# EAGLE design saha-cpu (EAGLE 9.4.0)

## Sheet 1 of 4
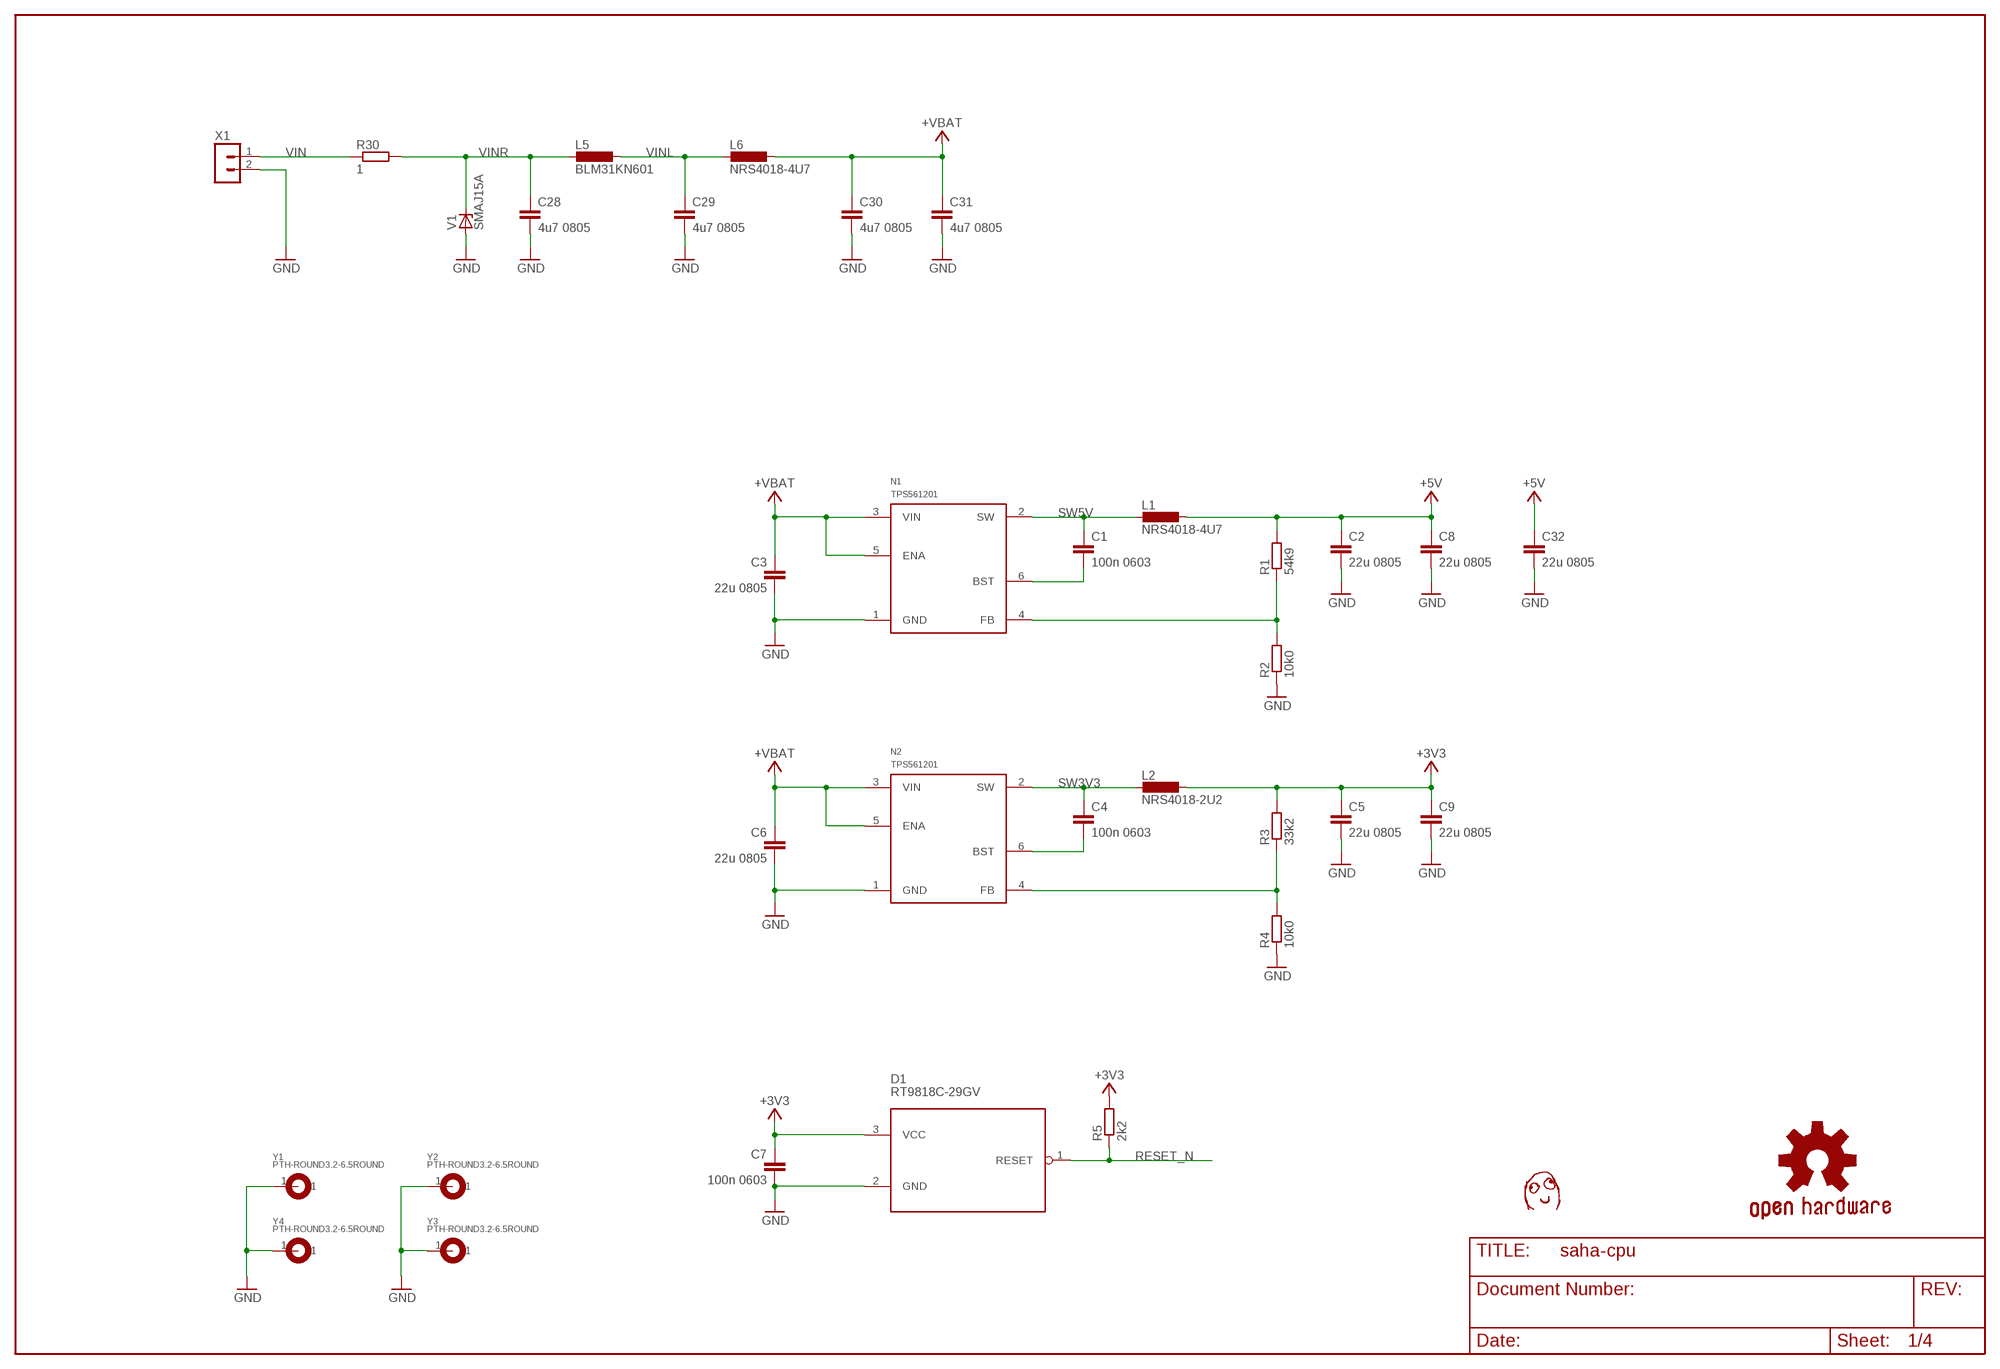
[diagram p0: schematic, sheet 1]

### Parts
C1  100n 0603  CAP0603  [C0603]
C2  22u 0805  CAP0805  [C0805]
C3  22u 0805  CAP0805  [C0805]
C4  100n 0603  CAP0603  [C0603]
C5  22u 0805  CAP0805  [C0805]
C6  22u 0805  CAP0805  [C0805]
C7  100n 0603  CAP0603  [C0603]
C8  22u 0805  CAP0805  [C0805]
C9  22u 0805  CAP0805  [C0805]
C28  4u7 0805  CAP0805  [C0805]
C29  4u7 0805  CAP0805  [C0805]
C30  4u7 0805  CAP0805  [C0805]
C31  4u7 0805  CAP0805  [C0805]
C32  22u 0805  CAP0805  [C0805]
D1  RT9818C-29GV  [SOT23]
L1  NRS4018-4U7  [NRS4018]
L2  NRS4018-2U2  [NRS4018]
L5  BLM31KN601  IND1206  [R1206]
L6  NRS4018-4U7  [NRS4018]
N1  TPS561201  [OMAT_IC_2_SOT23-6]
N2  TPS561201  [OMAT_IC_2_SOT23-6]
R1  54k9  RES0603  [R0603]
R2  10k0  RES0603  [R0603]
R3  33k2  RES0603  [R0603]
R4  10k0  RES0603  [R0603]
R5  2k2  RES0603  [R0603]
R30  1  RES2512  [R2512]
U$1  DAFUG  [DAFUG]
V1  SMAJ15A  SMAJXXA  [DO214AC]
X1  TE_RUUVILIITIN2  [TE_RUUVILIITIN2]
Y1  PTH-ROUND3.2-6.5ROUND  [EKE_PTH-3.2-6.5]
Y2  PTH-ROUND3.2-6.5ROUND  [EKE_PTH-3.2-6.5]
Y3  PTH-ROUND3.2-6.5ROUND  [EKE_PTH-3.2-6.5]
Y4  PTH-ROUND3.2-6.5ROUND  [EKE_PTH-3.2-6.5]

### Nets
+3V3 [power]: C5.1 C7.1 C9.1 D1.3(VCC) L2.1 R3.2 R5.2 ; also sheet 2,3,4
+5V [power]: C2.1 C8.1 C32.1 L1.1 R1.2 ; also sheet 3,4
+VBAT [power]: C3.1 C6.1 C30.1 C31.1 L6.1 N1.3(VIN) N1.5(ENA) N2.3(VIN) N2.5(ENA) ; also sheet 2
GND [power]: C2.2 C3.2 C5.2 C6.2 C7.2 C8.2 C9.2 C28.2 C29.2 C30.2 C31.2 C32.2 D1.2(GND) N1.1(GND) N2.1(GND) R2.1 R4.1 V1.A X1.2 Y1.1 Y2.1 Y3.1 Y4.1 ; also sheet 2,3,4
N$1: N2.4(FB) R3.1 R4.2
N$3: N1.4(FB) R1.1 R2.2
N$5: C1.2 N1.6(BST)
N$7: C4.2 N2.6(BST)
RESET_N: D1.1(RESET) R5.1 ; also sheet 2
SW3V3: C4.1 L2.2 N2.2(SW)
SW5V: C1.1 L1.2 N1.2(SW)
VIN: R30.1 X1.1
VINL: C29.1 L5.1 L6.2
VINR: C28.1 L5.2 R30.2 V1.C

## Sheet 2 of 4
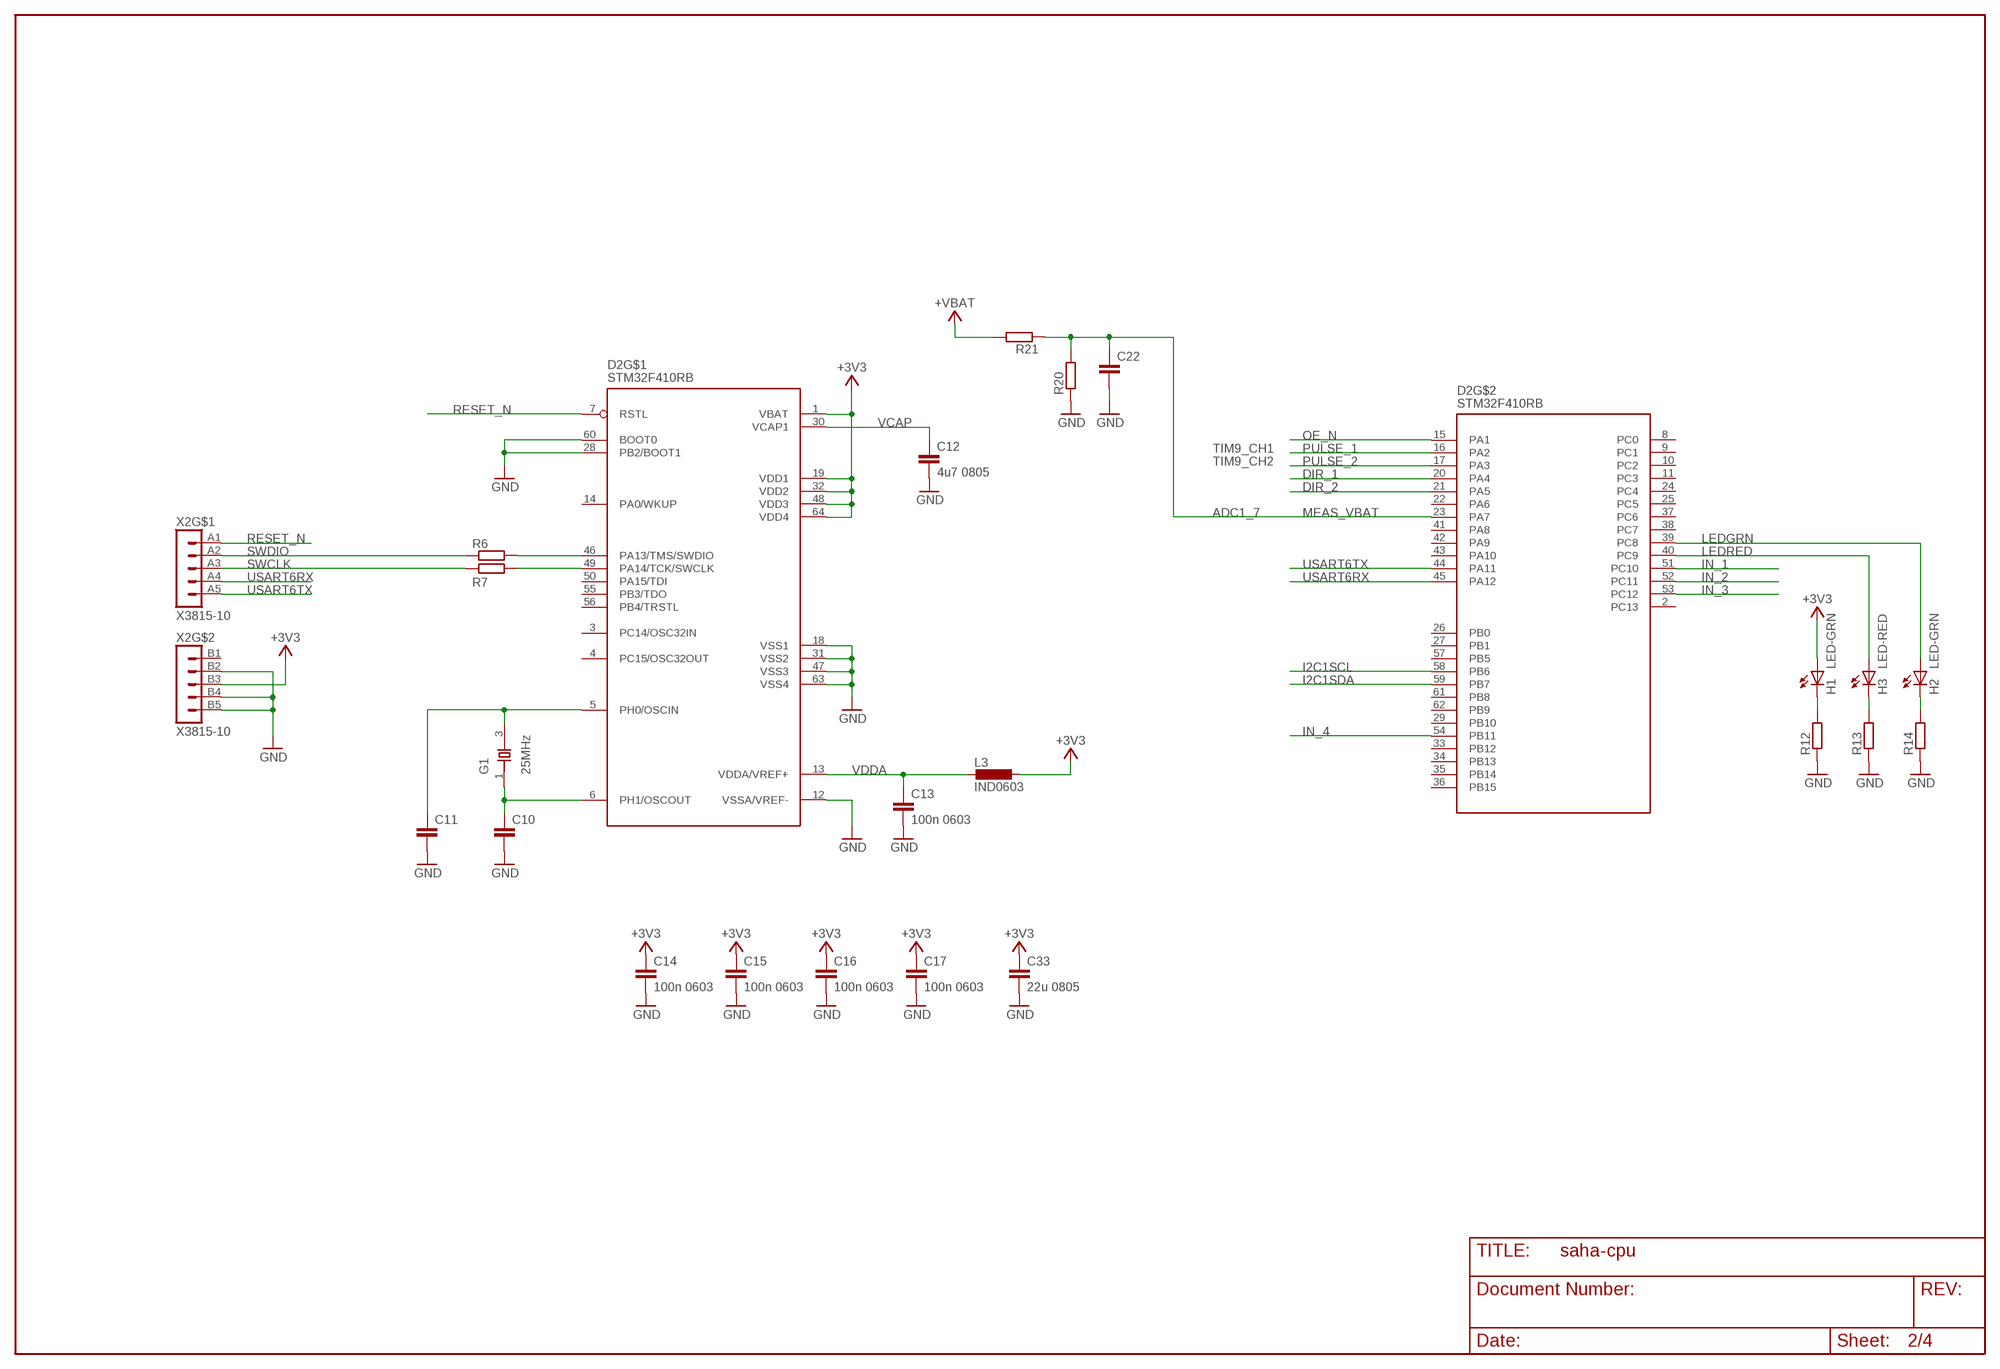
[diagram p1: schematic, sheet 2]

### Parts
C10  CAP0603  [C0603]
C11  CAP0603  [C0603]
C12  4u7 0805  CAP0805  [C0805]
C13  100n 0603  CAP0603  [C0603]
C14  100n 0603  CAP0603  [C0603]
C15  100n 0603  CAP0603  [C0603]
C16  100n 0603  CAP0603  [C0603]
C17  100n 0603  CAP0603  [C0603]
C22  CAP0603  [C0603]
C33  22u 0805  CAP0805  [C0805]
D2  STM32F410RB  [LQFP-64]
G1  25MHz  XTAL_3225_SMD  [X_3225]
H1  LED-GRN  [CHIP-LED0603]
H2  LED-GRN  [CHIP-LED0603]
H3  LED-RED  [CHIP-LED0603]
L3  IND0603  [R0603]
R6  RES0603  [R0603]
R7  RES0603  [R0603]
R12  RES0603  [R0603]
R13  RES0603  [R0603]
R14  RES0603  [R0603]
R20  RES0603  [R0603]
R21  RES0603  [R0603]
X2  X3815-10  [AUX-IO_LIITTIMET_15110102601]

### Nets
+3V3 [power]: C14.1 C15.1 C16.1 C17.1 C33.1 D2.1(VBAT) D2.19(VDD1) D2.32(VDD2) D2.48(VDD3) D2.64(VDD4) H1.A L3.1 X2.B3 ; also sheet 1,3,4
+VBAT [power]: R21.2 ; also sheet 1
DIR_1: D2.20(PA4) ; also sheet 3
DIR_2: D2.21(PA5) ; also sheet 3
GND [power]: C10.2 C11.2 C12.2 C13.2 C14.2 C15.2 C16.2 C17.2 C22.2 C33.2 D2.12(VSSA/VREF-) D2.18(VSS1) D2.28(PB2/BOOT1) D2.31(VSS2) D2.47(VSS3) D2.60(BOOT0) D2.63(VSS4) R12.1 R13.1 R14.1 R20.1 X2.B2 X2.B4 X2.B5 ; also sheet 1,3,4
I2C1SCL: D2.58(PB6) ; also sheet 3
I2C1SDA: D2.59(PB7) ; also sheet 3
IN_1: D2.51(PC10) ; also sheet 4
IN_2: D2.52(PC11) ; also sheet 4
IN_3: D2.53(PC12) ; also sheet 4
IN_4: D2.54(PB11) ; also sheet 4
LEDGRN: D2.39(PC8) H2.A
LEDRED: D2.40(PC9) H3.A
MEAS_VBAT: C22.1 D2.23(PA7) R20.2 R21.1
N$22: H1.C R12.2
N$23: H3.C R13.2
N$24: H2.C R14.2
OE_N: D2.15(PA1) ; also sheet 3
OSCIN: C11.1 D2.5(PH0/OSCIN) G1.3(X2)
OSCOUT: C10.1 D2.6(PH1/OSCOUT) G1.1(X1)
PULSE_1: D2.16(PA2) ; also sheet 3
PULSE_2: D2.17(PA3) ; also sheet 3
RESET_N: D2.7(RSTL) X2.A1 ; also sheet 1
SWCLK: R7.1 X2.A3
SWCLK-CPU: D2.49(PA14/TCK/SWCLK) R7.2
SWDIO: R6.1 X2.A2
SWDIO-CPU: D2.46(PA13/TMS/SWDIO) R6.2
USART6RX: D2.45(PA12) X2.A4
USART6TX: D2.44(PA11) X2.A5
VCAP [power]: C12.1 D2.30(VCAP1)
VDDA [power]: C13.1 D2.13(VDDA/VREF+) L3.2
Unconnected: D2.2(PC13) D2.3(PC14/OSC32IN) D2.4(PC15/OSC32OUT) D2.8(PC0) D2.9(PC1) D2.10(PC2) D2.11(PC3) D2.14(PA0/WKUP) D2.22(PA6) D2.24(PC4) D2.25(PC5) D2.26(PB0) D2.27(PB1) D2.29(PB10) D2.33(PB12) D2.34(PB13) D2.35(PB14) D2.36(PB15) D2.37(PC6) D2.38(PC7) D2.41(PA8) D2.42(PA9) D2.43(PA10) D2.50(PA15/TDI) D2.55(PB3/TDO) D2.56(PB4/TRSTL) D2.57(PB5) D2.61(PB8) D2.62(PB9) X2.B1

### Notes on the sheet
- TIM9_CH1
- TIM9_CH2
- ADC1_7

## Sheet 3 of 4
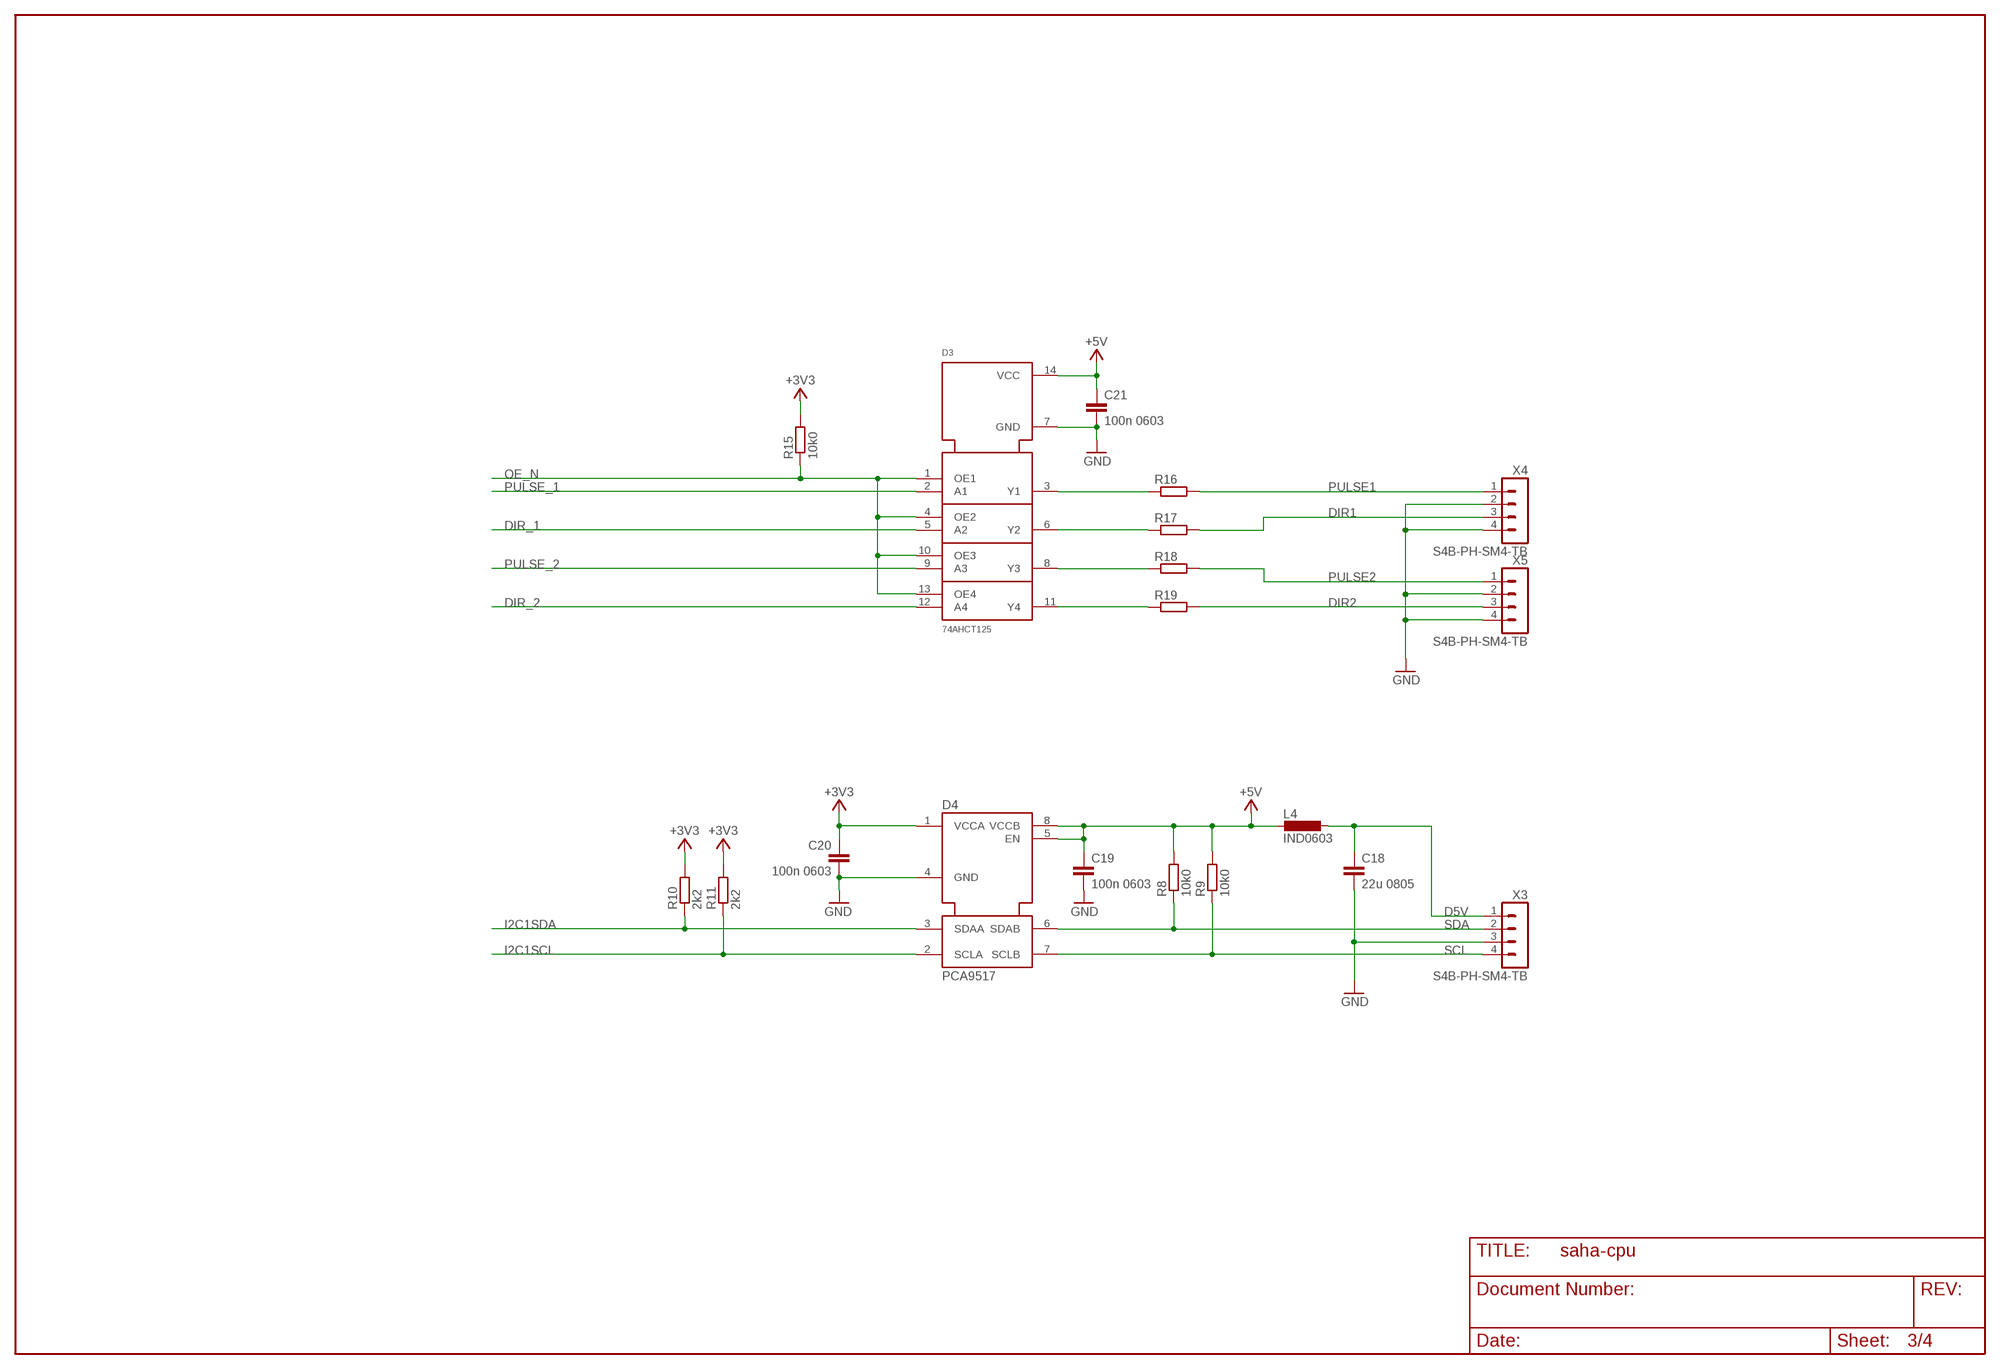
[diagram p2: schematic, sheet 3]

### Parts
C18  22u 0805  CAP0805  [C0805]
C19  100n 0603  CAP0603  [C0603]
C20  100n 0603  CAP0603  [C0603]
C21  100n 0603  CAP0603  [C0603]
D3  74AHCT125  [SO14]
D4  PCA9517  [OMAT_IC_2_SOIC8-N_MC]
L4  IND0603  [R0603]
R8  10k0  RES0603  [R0603]
R9  10k0  RES0603  [R0603]
R10  2k2  RES0603  [R0603]
R11  2k2  RES0603  [R0603]
R15  10k0  RES0603  [R0603]
R16  RES0603  [R0603]
R17  RES0603  [R0603]
R18  RES0603  [R0603]
R19  RES0603  [R0603]
X3  S4B-PH-SM4-TB  [JST-PH2.0-RA-4]
X4  S4B-PH-SM4-TB  [JST-PH2.0-RA-4]
X5  S4B-PH-SM4-TB  [JST-PH2.0-RA-4]

### Nets
+3V3 [power]: C20.1 D4.1(VCCA) R10.2 R11.2 R15.2 ; also sheet 1,2,4
+5V [power]: C19.1 C21.1 D3.14(VCC) D4.5(EN) D4.8(VCCB) L4.2 R8.2 R9.2 ; also sheet 1,4
D5V: C18.1 L4.1 X3.1
DIR1: R17.2 X4.3
DIR2: R19.2 X5.3
DIR_1: D3.5(A2) ; also sheet 2
DIR_2: D3.12(A4) ; also sheet 2
GND [power]: C18.2 C19.2 C20.2 C21.2 D3.7(GND) D4.4(GND) X3.3 X4.2 X4.4 X5.2 X5.4 ; also sheet 1,2,4
I2C1SCL: D4.2(SCLA) R11.1 ; also sheet 2
I2C1SDA: D4.3(SDAA) R10.1 ; also sheet 2
N$21: D3.11(Y4) R19.1
N$25: D3.8(Y3) R18.1
N$26: D3.6(Y2) R17.1
N$27: D3.3(Y1) R16.1
OE_N: D3.1(OE1) D3.4(OE2) D3.10(OE3) D3.13(OE4) R15.1 ; also sheet 2
PULSE1: R16.2 X4.1
PULSE2: R18.2 X5.1
PULSE_1: D3.2(A1) ; also sheet 2
PULSE_2: D3.9(A3) ; also sheet 2
SCL: D4.7(SCLB) R9.1 X3.4
SDA: D4.6(SDAB) R8.1 X3.2

## Sheet 4 of 4
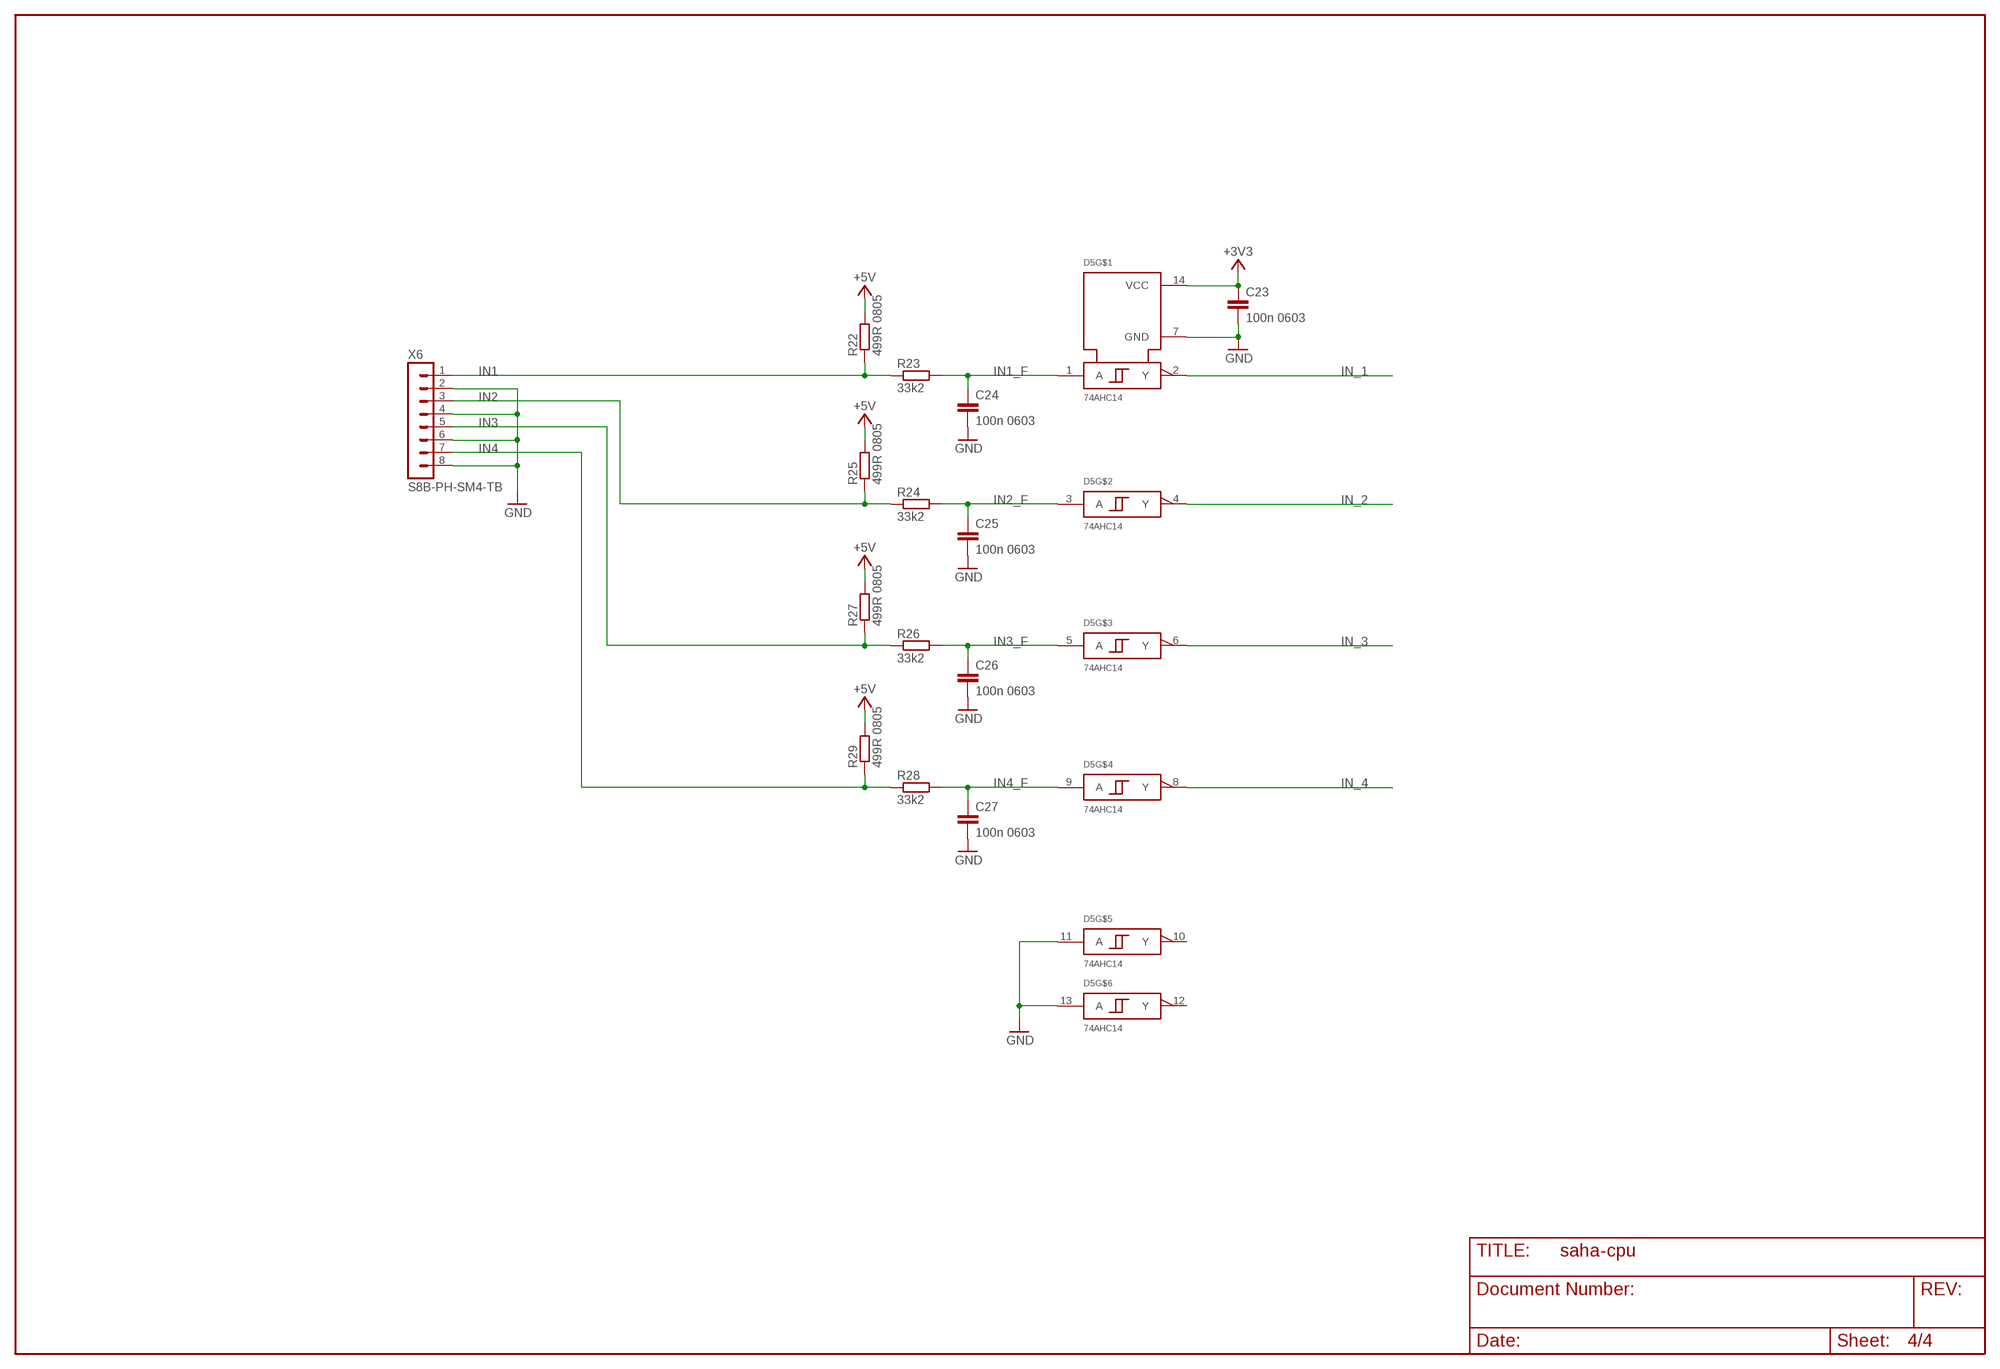
[diagram p3: schematic, sheet 4]

### Parts
C23  100n 0603  CAP0603  [C0603]
C24  100n 0603  CAP0603  [C0603]
C25  100n 0603  CAP0603  [C0603]
C26  100n 0603  CAP0603  [C0603]
C27  100n 0603  CAP0603  [C0603]
D5  74AHC14  [SO14]
R22  499R 0805  RES0805  [R0805]
R23  33k2  RES0603  [R0603]
R24  33k2  RES0603  [R0603]
R25  499R 0805  RES0805  [R0805]
R26  33k2  RES0603  [R0603]
R27  499R 0805  RES0805  [R0805]
R28  33k2  RES0603  [R0603]
R29  499R 0805  RES0805  [R0805]
X6  S8B-PH-SM4-TB  [JST-PH2.0-RA-8]

### Nets
+3V3 [power]: C23.1 D5.14(VCC) ; also sheet 1,2,3
+5V [power]: R22.2 R25.2 R27.2 R29.2 ; also sheet 1,3
GND [power]: C23.2 C24.2 C25.2 C26.2 C27.2 D5.7(GND) D5.11(A) D5.13(A) X6.2 X6.4 X6.6 X6.8 ; also sheet 1,2,3
IN1: R22.1 R23.1 X6.1
IN1_F: C24.1 D5.1(A) R23.2
IN2: R24.1 R25.1 X6.3
IN2_F: C25.1 D5.3(A) R24.2
IN3: R26.1 R27.1 X6.5
IN3_F: C26.1 D5.5(A) R26.2
IN4: R28.1 R29.1 X6.7
IN4_F: C27.1 D5.9(A) R28.2
IN_1: D5.2(Y) ; also sheet 2
IN_2: D5.4(Y) ; also sheet 2
IN_3: D5.6(Y) ; also sheet 2
IN_4: D5.8(Y) ; also sheet 2
Unconnected: D5.10(Y) D5.12(Y)

## Library data of the parts
C1-C33 = saha-cpu:CAP
D1 = saha-cpu:RT9818C-29GV
D2 = saha-cpu:STM32F410RB
D3 = saha-cpu:74AHCT125
D4 = saha-cpu:PCA9517
D5 = saha-cpu:74AHC14
G1 = saha-cpu:XTAL_3225_SMD: CRYSTAL CLOCK OSCILLATORS 5.0 Vdc or 3.3 Vdc - LOW PROFILE ULTRA MINIATURE CERAMIC SURFACE MOUNT Source: http://www.abracon.com/Oscillators/asf1-L-L1.pdf
H1-H3 = saha-cpu:LED
L1 L2 L6 = saha-cpu:NRS4018
L3-L5 = saha-cpu:IND
N1 N2 = saha-cpu:TPS561201
R1-R30 = saha-cpu:RES
U$1 = saha-cpu:DAFUG
V1 = saha-cpu:SMAJXXA
X1 = saha-cpu:TE_RUUVILIITIN2
X2 = saha-cpu:X3815-10
X3-X5 = saha-cpu:S4B-PH-SM4-TB
X6 = saha-cpu:S8B-PH-SM4-TB
Y1-Y4 = saha-cpu:PTH-ROUND

## Net classes
0 default: width 0.15 mm, drill 0.3 mm
1 power: width 0.3 mm, drill 0.3 mm

## Board
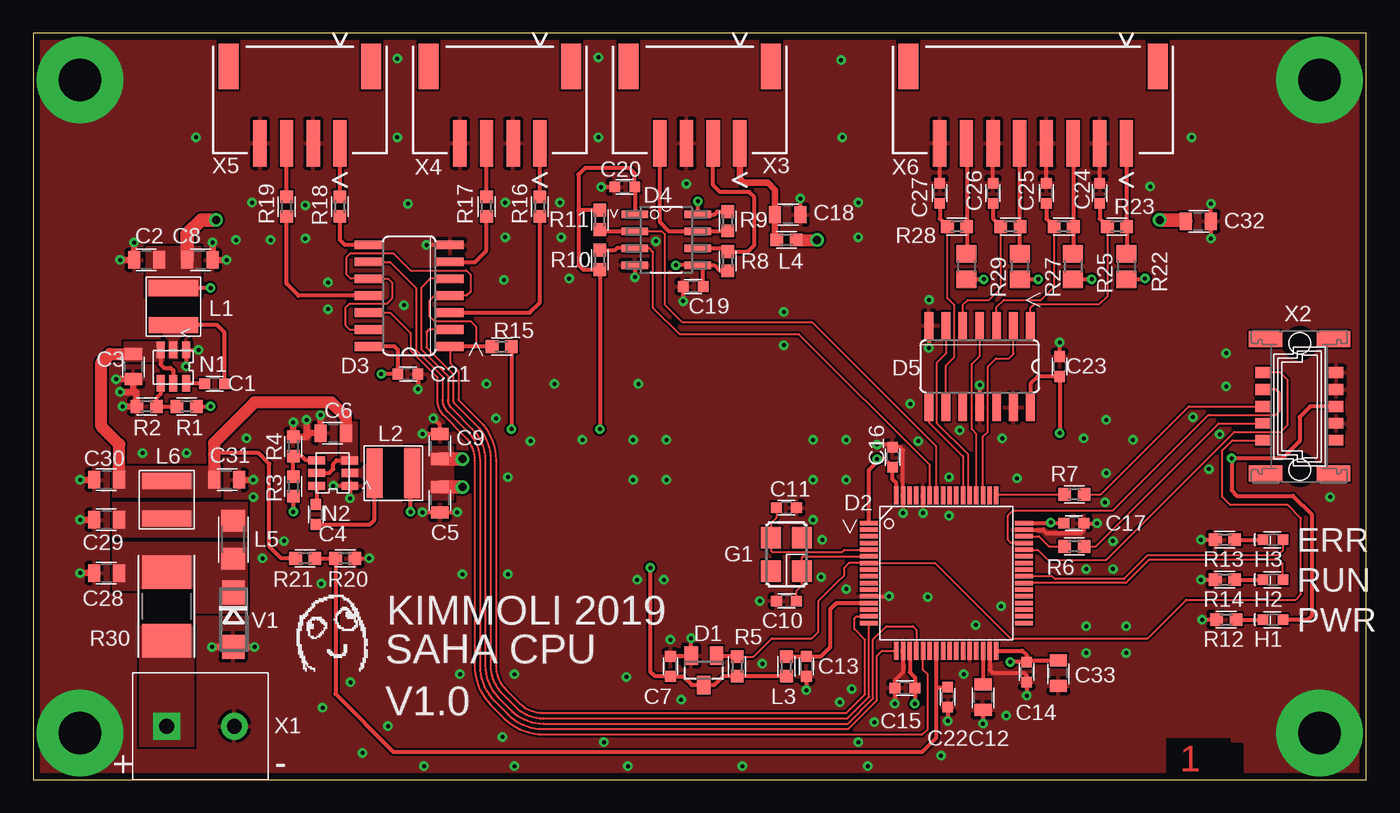
[diagram p4: board, top side]
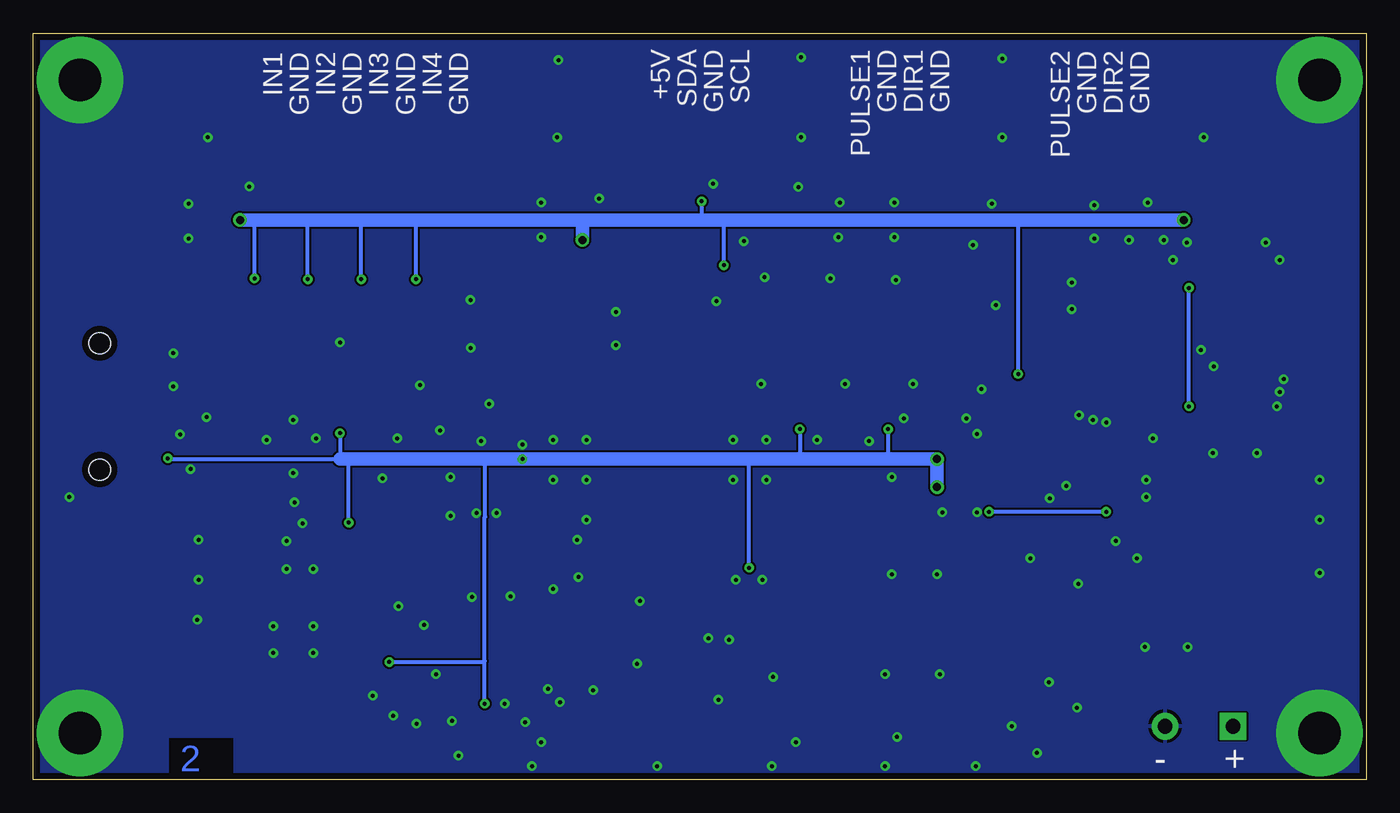
[diagram p5: board, bottom side, seen from below]

Size 100 x 56 mm. Coordinates in mm from the lower left corner, seen from the top.
Outline: 0,0 100,0 100,56 0,56 0,0
Copper layers (1*16): Top 0.035mm / dielectric 1.5mm / Bottom 0.035mm
Design rules "default *": minimum track width 0.15mm, minimum drill 0.3mm, track to track 6mil, track to pad 6mil, pad to pad 6mil, via to via 6mil, smd to smd 6mil, copper to edge 20mil, drill to drill 6mil, minimum pad ring 10mil, minimum via ring 8mil, stop-mask expansion 4mil, vias tented up to drill 0mil, thermal gap 10mil
tRestrict: area 85,0.4 to 89.8,3.1; area 26.2,21 to 27.8,25; area 7.9,11.7 to 12.1,14.3; area 8.5,34.8 to 12.5,36.2
bRestrict: area 85,0.4 to 89.8,3.1

### Footprints (pad centres in the part's own frame; a part is rotated, then mirrored left to right if it is on the bottom)
C0603 = smd 0.8 x 0.8: 1 -0.75,0; 2 0.75,0
C0805 = smd 0.9 x 1.3: 1 -0.95,0; 2 0.95,0
SOT23 = smd 1 x 1.4: 1 -0.95,-1.1; 2 0.95,-1.1; 3 0,1.1
LQFP-64 = smd 0.34 x 1.35: 1 -3.75,-5.825; 2 -3.25,-5.825; 3 -2.75,-5.825; 4 -2.25,-5.825; 5 -1.75,-5.825; 6 -1.25,-5.825; 7 -0.75,-5.825; 8 -0.25,-5.825; 9 0.25,-5.825; 10 0.75,-5.825; 11 1.25,-5.825; 12 1.75,-5.825; 13 2.25,-5.825; 14 2.75,-5.825; 15 3.25,-5.825; 16 3.75,-5.825; 33 3.75,5.825; 34 3.25,5.825; 35 2.75,5.825; 36 2.25,5.825; 37 1.75,5.825; 38 1.25,5.825; 39 0.75,5.825; 40 0.25,5.825; 41 -0.25,5.825; 42 -0.75,5.825; 43 -1.25,5.825; 44 -1.75,5.825; 45 -2.25,5.825; 46 -2.75,5.825; 47 -3.25,5.825; 48 -3.75,5.825 | smd 1.35 x 0.34: 17 5.825,-3.75; 18 5.825,-3.25; 19 5.825,-2.75; 20 5.825,-2.25; 21 5.825,-1.75; 22 5.825,-1.25; 23 5.825,-0.75; 24 5.825,-0.25; 25 5.825,0.25; 26 5.825,0.75; 27 5.825,1.25; 28 5.825,1.75; 29 5.825,2.25; 30 5.825,2.75; 31 5.825,3.25; 32 5.825,3.75; 49 -5.825,3.75; 50 -5.825,3.25; 51 -5.825,2.75; 52 -5.825,2.25; 53 -5.825,1.75; 54 -5.825,1.25; 55 -5.825,0.75; 56 -5.825,0.25; 57 -5.825,-0.25; 58 -5.825,-0.75; 59 -5.825,-1.25; 60 -5.825,-1.75; 61 -5.825,-2.25; 62 -5.825,-2.75; 63 -5.825,-3.25; 64 -5.825,-3.75
SO14 = smd 0.66 x 2.032: 1 -3.81,-3.073; 2 -2.54,-3.073; 3 -1.27,-3.073; 4 0,-3.073; 5 1.27,-3.073; 6 2.54,-3.073; 7 3.81,-3.073; 8 3.81,3.073; 9 2.54,3.073; 10 1.27,3.073; 11 0,3.073; 12 -1.27,3.073; 13 -2.54,3.073; 14 -3.81,3.073
OMAT_IC_2_SOIC8-N_MC = smd 1.981 x 0.559: 1 -2.362,1.905; 2 -2.362,0.635; 3 -2.362,-0.635; 4 -2.362,-1.905; 5 2.362,-1.905; 6 2.362,-0.635; 7 2.362,0.635; 8 2.362,1.905
X_3225 = smd 1.6 x 1.5: 1 -1.25,-1.15; 2 1.25,-1.15; 3 1.25,1.15; 4 -1.25,1.15
CHIP-LED0603 = smd 0.8 x 0.8: A -0.75,0; C 0.75,0
NRS4018 = smd 1.2 x 3.7: 1 -1.4,0; 2 1.4,0
R0603 = smd 0.95 x 0.95: 1 -0.725,0; 2 0.725,0
R1206 = smd 1.6 x 1.803: 1 -1.422,0; 2 1.422,0
OMAT_IC_2_SOT23-6 = smd 1.25 x 0.6: 1 -1.25,0.95; 2 -1.25,0; 3 -1.25,-0.95; 4 1.25,-0.95; 5 1.25,0; 6 1.25,0.95
R0805 = smd 1.3 x 1.5: 1 -0.95,0; 2 0.95,0
R2512 = smd 2.5 x 3.7: 1 -2.575,0; 2 2.575,0
DO214AC = smd 1.8 x 1.7: A 2.05,0; C -2.05,0
TE_RUUVILIITIN2 = drill 1.1 pad 2 square: 1 0,0 | drill 1.1 pad 2: 2 5.08,0
AUX-IO_LIITTIMET_15110102601 = smd 0.8 x 1.1: A1 -2.54,2.765; A2 -1.27,2.765; A3 0,2.765; A4 1.27,2.765; A5 2.54,2.765; B1 -2.54,-2.74; B2 -1.27,-2.74; B3 0,-2.74; B4 1.27,-2.74; B5 2.54,-2.74 | smd 1.2 x 2.5: M1 -5.045,2.55; M2 -5.045,-2.55; M3 5.045,-2.55; M4 5.045,2.55 | hole 1.6: -4.738,-0.022; 4.738,-0.022
JST-PH2.0-RA-4 = smd 1 x 3.5: 1 3,-7.25; 2 1,-7.25; 3 -1,-7.25; 4 -3,-7.25 | smd 1.5 x 3.4: M1 5.35,-1.5; M2 -5.35,-1.5
JST-PH2.0-RA-8 = smd 1 x 3.5: 1 7,-7.25; 2 5,-7.25; 3 3,-7.25; 4 1,-7.25; 5 -1,-7.25; 6 -3,-7.25; 7 -5,-7.25; 8 -7,-7.25 | smd 1.5 x 3.4: M1 9.35,-1.5; M2 -9.35,-1.5
EKE_PTH-3.2-6.5 = drill 3.2 pad 6.5: 1 0,0

### Placement (x,y rotation side)
C1  13.6,29.7 180 top
C2  8.5,39 180 top
C3  7.5,31 270 top
C4  21.2,19.9 90 top
C5  30.5,21 270 top
C6  22.5,26 180 top
C7  47.8,8.5 90 top
C8  12.5,39 0 top
C9  30.5,25 90 top
C10  56.5,13.4 180 top
C11  56.5,20.4 0 top
C12  71.25,6.18 270 top
C13  58,8.5 270 top
C14  74.53,8.07 270 top
C15  65.39,6.87 180 top
C16  64.47,24.19 90 top
C17  78.07,19.23 0 top
C18  56.6,42.4 0 top
C19  49.5,37 180 top
C20  44.37,44.47 180 top
C21  28.11,30.43 0 top
C22  68.6,6.2 270 top
C23  77,31 90 top
C24  80,44 90 top
C25  76,44 90 top
C26  72,44 90 top
C27  68,44 90 top
C28  5.5,15.5 180 top
C29  5.5,19.5 180 top
C30  5.5,22.5 180 top
C31  14.5,22.5 0 top
C32  87.4,41.9 0 top
C33  76.9,8 270 top
D1  50.3,8.2 180 top
D2  68.5,15.5 270 top
D3  28.21,36.31 90 top
D4  47.5,40.5 0 top
D5  71,31 180 top
G1  56.5,16.9 90 top
H1  93,12 180 top
H2  93,15 180 top
H3  93,18 180 top
L1  10.5,35.5 270 top
L2  27,23 180 top
L3  56.5,8.5 90 top
L4  56.5,40.5 0 top
L5  15,18 270 top
L6  10,21 270 top
N1  10.5,31 270 top
N2  22.5,23 180 top
R1  11.5,28 0 top
R2  8.5,28 0 top
R3  19.5,22 270 top
R4  19.5,25 270 top
R5  52.8,8.5 270 top
R6  78.1,17.5 180 top
R7  78.1,21.4 180 top
R8  52.1,38.9 270 top
R9  52.1,41.9 90 top
R10  42.5,39 270 top
R11  42.5,42 90 top
R12  89.5,12 0 top
R13  89.4,18 0 top
R14  89.4,15 0 top
R15  35.14,32.49 0 top
R16  38,43 90 top
R17  34,43 90 top
R18  23,43 90 top
R19  19,43 90 top
R20  23.4,16.6 180 top
R21  20.4,16.6 180 top
R22  82,38.5 270 top
R23  81.3,41.5 180 top
R24  77.3,41.5 180 top
R25  78,38.5 270 top
R26  73.3,41.5 180 top
R27  74,38.5 270 top
R28  69.3,41.5 180 top
R29  70,38.5 270 top
R30  10,13 90 top
U$1  22.6,10.73 0 top
V1  15,12 270 top
X1  10,4 0 top
X2  95,28 90 top
X3  50,55 0 top
X4  35,55 0 top
X5  20,55 0 top
X6  75,55 0 top
Y1  3.5,52.5 0 top
Y2  96.5,52.5 0 top
Y3  3.5,3.5 0 top
Y4  96.5,3.5 0 top

### Tracks (layer width: path | path; a pad name or v marks a point on that pad's centre or on a via)
+3V3  (via drill 0.3, 0.6)
  Top 0.3: D2.48 76.1,19.25 | 76.1,19.25 77.3,19.25 C17.1 | D2.64 64.75,22.25 64.47,22.53 C16.1 63.86,24.05 63.5,24.05 | D2.19 65.75,8.05 66.14,7.66 C15.1 v66.14,5.7 | L3.1 R5.2 51.77,7.78 51.1,7.1 D1.3 49.4,7.1 48.75,7.75 C7.1 46.65,7.75 46.3,8.1 v46.3,15.9 | D2.32 74.2,9.68 74.53,9.35 C14.1 | D5.14 74.81,29.71 75.35,30.25 C23.1 v77,26 | D4.1 45.14,44.45 C20.1 45.12,45.5 44.72,45.9 41.4,45.9 40.9,45.4 40.9,42.7 | R3.2 v19.5,20.1 | v28.3,20.1 28.3,22.9 L2.1 | X2.B3 95.8,28 95,27.2 95,25.4 93.7,24.1 v89.9,24.1 89.9,21.7 90.3,21.3 94.5,21.3 95.9,19.9 95.9,12.3 95.6,12 H1.A | R15.2 v35.87,26.3 | v42.5,26.3 R10.2 41.23,38.27 40.9,38.6 40.9,42.7 | R11.2 40.92,42.73 40.9,42.7 | 76.1,19.25 76.14,19.29 v76.34,19.29 | 63.5,24.05 v63.3,24.05 | D2.1 62.67,23.23 63.5,24.05 | C14.1 v73.3,8.82 | C14.1 74.66,8.95 C33.1
  Top 1: C9.1 v32.2,24.05 | C5.1 v32.2,21.95
  Bottom 0.3: v19.5,20.1 v28.3,20.1 | v35.87,26.3 35.87,24.11 35.8,24.05 | v42.5,26.3 42.5,24.15 42.4,24.05 | v77,26 77,24.05 89.85,24.05 v89.9,24.1 | v76.34,19.29 76.34,23.89 76.5,24.05 | v66.14,5.7 66.14,8.9 | 66.14,8.9 66.14,19.68 66.09,19.73 66.09,23.84 66.3,24.05 | v73.3,8.82 66.22,8.82 66.14,8.9 | v46.3,15.9 46.3,24.05
  Bottom 1: 77,24.05 76.5,24.05 66.3,24.05 v63.3,24.05 46.3,24.05 42.4,24.05 35.8,24.05 v32.2,24.05 v32.2,21.95
  pour Top (no thermals): 27.5,25 31.5,25 31.5,21 27.5,21
+5V  (via drill 0.3, 0.6)
  Top 0.3: D3.14 27.1,32.5 27.36,32.24 C21.1 v26.1,30.43 | R8.2 51.52,38.17 51.1,38.59 50.3,38.59 | 50.3,38.59 D4.5 v48.2,38.59 | R9.2 51.33,42.62 51.1,42.41 D4.8 v49.86,43.4 | R22.2 83.35,37.55 v83.4,37.6 | R25.2 v79.4,37.55 | R27.2 v75.4,37.55 | R29.2 v71.3,37.55 | C19.1 50.25,38.55 50.3,38.59 | R1.2 v13.3,28 | v13.3,36.9 L1.1
  Top 0.9: L4.2 v58.8,40.5
  Top 1: C8.1 11.55,40.95 12.6,42 v13.7,42 | v84.5,42 86.35,42 C32.1
  Bottom 0.3: v83.4,37.6 83.4,42 | v79.4,37.55 79.4,42 | v75.4,37.55 75.4,41.9 75.5,42 | v71.3,37.55 71.3,41.8 71.5,42 | v49.86,43.4 49.86,42.06 49.8,42 | v48.2,38.59 48.2,42 | v26.1,30.43 26.1,42 | v13.3,28 v13.3,36.9
  Bottom 1: 58.8,42 71.5,42 75.5,42 79.4,42 83.4,42 v84.5,42 | 58.8,42 49.8,42 48.2,42 26.1,42 v13.7,42 | v58.8,40.5 58.8,42
  pour Top (no thermals): 8.5,36.5 8.5,40 12.5,40 12.5,36 8.5,36
+VBAT
  Top 0.3: N1.5 10.5,30.7 10.3,30.9 9.8,30.9 9.55,31.15 N1.3 | R21.2 18.6,16.6 17.7,17.5 17.7,23.7 16.9,24.5 13.65,24.5 13.55,24.4 | N2.5 22.2,23 22.5,23.3 22.5,23.7 22.75,23.95 N2.3
  Top 0.9: C6.1 23.45,27.2 22.35,28.3 16.6,28.3 13.55,25.25 13.55,24.4 C31.1 | C3.1 5.75,31.95 5.1,31.3 5.1,26.5 6.45,25.15 C30.1
  pour Top (isolate 0.254, no thermals): 6,21.2 6,23.5 14,23.5 14,21.2
  pour Top (no thermals): 6.8,31.4 9.8,31.4 9.8,32.8 6.8,32.8
  pour Top (no thermals): 23,26.8 23,23.7 24.3,23.7 24.3,26.8
D5V
  Top 0.5: X3.1 53,45.1 53.3,44.8 55.1,44.8 55.65,44.25 C18.1 55.65,40.62 L4.1
DIR1
  Top 0.3: R17.2 X4.3
DIR2
  Top 0.3: R19.2 X5.3
DIR_1
  Top 0.15: D3.5 29.78,37.58 29.1,36.9 29.1,32.3 31.1,30.3 31.1,28.5 arc45 31.35,27.9 32.93,26.32 arc-45 33.91,23.96 33.91,8.54 arc45 34.89,6.17 35.89,5.17 arc45 38.25,4.19 61.12,4.19 63.01,6.08 63.01,10.51 64,11.5 66,11.5 66.25,11.25 D2.20
DIR_2
  Top 0.15: D3.12 26.76,35.04 28.3,33.5 28.3,32.21 30.3,30.21 30.3,28.48 arc45 30.77,27.34 32.36,25.75 arc-45 33.1,23.96 33.1,8.54 arc45 34.32,5.6 35.32,4.6 arc45 38.25,3.39 66.7,3.39 67.1,3.79 67.1,7.9 66.75,8.25 D2.21
GND  (via drill 0.3)
  Top 0.3: R2.1 7.7,28.07 | C27.2 X6.8 | C26.2 X6.6 | C25.2 X6.4 | C24.2 X6.2 | D2.47 75.75,18.75 76,18.5 78.6,18.5 78.82,18.72 C17.2 v79.8,19.23 | D2.18 65.25,8.05 64.64,7.44 C15.2 v64.64,5.7 | C7.2 47.85,9.3 D1.2 v49.35,10.6 | D2.31 71.75,8.25 72,8 74.3,8 74.53,7.77 C14.2 v74.53,6.3 | C22.2 v68.6,4.4 | C12.2 v71.25,4.2 | v63.3,25.14 64.27,25.14 C16.2 65.01,24.94 65.25,24.7 D2.63 v65.25,20 | C23.2 v77,32.8 | D5.11 v71,29.6 | D5.7 v67.19,32.4 | v88.35,43.2 C32.2 v88.35,40.6 | C18.2 v57.55,43.6 | C19.2 v48.75,35.9 | D4.4 v45.14,37.7 | C20.2 v42.6,44.47 | C21.2 v28.86,29.3 | R20.1 v25.2,16.6 | v29.2,20.05 C5.2 v31.8,20.05 | v29.2,25.95 C9.2 30.5,26.6 v30,27.1 | v23.75,21.1 N2.1 v22.5,22.05 | v11.45,31 N1.1 v12.4,32.25 | R14.1 v87.6,15 | R12.1 v87.7,12 | R13.1 v87.6,18 | D3.7 v29.5,40.12 | D2.60 v66.75,20 | C13.2 v58,6.7 | D2.12 v64.2,13.75
  Top 0.5: 7.7,28.07 7.7,29.1 7.5,29.1 | 7.5,29.1 C3.2 v6.2,30.05 | R2.1 v6.7,28 | 7.5,29.1 v6.5,29.1 | 20.5,25.73 R4.1 v19.5,26.8 | 20.5,25.73 20.77,26 C6.2 v21.55,27.34 | 20.5,25.73 v20.5,27 | v14.5,39 C8.2 v13.45,40.3 | v7.55,40.3 C2.2 v6.5,39 | C31.2 v16.5,22.5 | C30.2 v3.5,22.5 | C29.2 v3.5,19.5 | C28.2 v3.5,15.5 | v16.6,9.95 V1.A v13.4,9.95
  other vias: 45,22.5 47.5,22.5 47.5,25.5 45,25.5 61,22.5 61,25.5 58.5,25.5 58.5,22.5 79,9.5 82,9.5 82,11.5 79,11.5 79,15.8 81,15.8 80.5,23 82.5,25.5 89.5,29.5 89.5,32 80.5,27 80.4,20.8 68.7,22.7 68.7,19.8 72.6,13 70.7,11.6 67.1,13.7 73,4.8 69.8,7.9 63.1,4.3 60.5,5.8 61.4,6.8 48.6,6 47.8,10.5 54.7,8.7 61,14.3 59.1,15.2 59.2,18 58.5,19.5 54.5,13.4 45.3,15 47.3,15 44.5,7.7 36.1,7.9 32,7.9 35.2,3.2 35.6,15.4 32.2,15.4 35.6,22.7 34.7,27.1 37.3,25.4 41.2,25.5 35.3,37.5 20.4,40.6 20.4,43.1 28.1,43.2 35.4,43.3 39.5,43.3 39.6,40.7 35.4,40.7 15.2,40.5 16.4,43.3 17.8,40.5 8.2,24.5 16,25.6 16.5,21.2 11.5,24.5 61.9,43.3 61.9,40.7 49,44.7 46.7,40.4 83.8,44.5 67.2,36 65.8,28.2 69.5,26.2 72.7,25.6 73.8,22.6 78.8,25.6 89,25.9 88.2,23.3 97.3,21.2 27.3,48.2 42.4,48.2 60.7,48.2 24.7,2 26.6,4 23.8,7.3 21.7,5.4 21.6,14.7 17.2,16.6 18.8,17.9 29.3,1 36.1,1 44.6,1 53.2,1 62.6,1 61.9,2.8 42.8,2.8 68.1,1.8 81,17.9 87,27.2 66.4,25.4 56.3,32.6 56.3,35.1 40.2,37.6 34,29.7 39.1,29.7 45.4,29.7 60.6,54 86.9,48.2 12.2,48.2 27.3,54.1 42.4,54.2 27.8,35.6 22.1,35.3 22.1,37.3
  pour Top (rank 2): 0,0 100,0 100,56 0,56
  pour Bottom (rank 2): 0,0 100,0 100,56 0,56
I2C1SCL
  Top 0.15: D2.58 67.75,25 58.45,34.3 48.7,34.3 47.4,35.6 47.4,40.9 47.17,41.13 D4.2
  Top 0.3: R11.1 42.64,41.13 D4.2
I2C1SDA
  Top 0.15: D2.59 67.25,23.6 57.45,33.4 48.5,33.4 46.5,35.4 46.5,39.6 46.23,39.87 D4.3
  Top 0.3: R10.1 42.52,39.7 43.6,39.7 43.77,39.87 D4.3
IN1
  Top 0.3: X6.1 82,41.52 R23.1 82.03,39.48 R22.1
IN1_F
  Top 0.15: R23.2 80.6,41.48 80.6,36.3 80,35.7 75.1,35.7 74.81,35.41 D5.1
  Top 0.3: C24.1 80,42.08 R23.2
IN2
  Top 0.3: X6.3 78.03,47.73 R24.1 78.03,39.48 R25.1
IN2_F
  Top 0.15: R24.2 76.6,41.48 76.6,37 75.6,36 72.8,36 72.27,35.47 D5.3
  Top 0.3: C25.1 76,42.08 R24.2
IN3
  Top 0.3: R27.1 74,41.48 R26.1 74,41.52 X6.5
IN3_F
  Top 0.15: D5.5 69.73,35.63 70.1,36 71.7,36 72.58,36.88 R26.2
  Top 0.3: C26.1 72,42.08 R26.2
IN4
  Top 0.3: X6.7 70.03,47.73 R28.1 70.03,39.48 R29.1
IN4_F
  Top 0.15: D5.9 68.46,31.06 69.1,31.7 69.1,35.6 68.58,36.12 R28.2
  Top 0.3: C27.1 68,42.08 R28.2
IN_1
  Top 0.15: D2.51 71.25,25.75 71.6,26.1 71.6,31 72.2,31.6 73.2,31.6 73.54,31.94 D5.2
IN_2
  Top 0.15: D2.52 70.75,25.95 70.4,26.3 70.4,31.2 71,31.8 D5.4
IN_3
  Top 0.15: D2.53 70.15,21.43 70.15,24.38 67.8,26.73 67.8,31.3 68.5,32 68.5,34.03 D5.6
IN_4
  Top 0.15: D5.8 67.19,26.81 69.75,24.25 D2.54
LEDGRN
  Top 0.15: H2.A 93.75,16.2 93.45,16.5 83.7,16.5 81.95,14.75 D2.39
LEDRED
  Top 0.15: H3.A 93.75,17.2 93.35,16.8 83.58,16.8 81.83,15.05 76.65,15.05 76.45,15.25 D2.40
MEAS_VBAT
  Top 0.3: R21.1 R20.2 22.68,6.42 27,2.1 66.7,2.1 67.75,3.15 67.75,6.9 | 67.75,6.9 D2.23 | C22.1 68.55,6.9 67.75,6.9
N$1
  Top 0.3: N2.4 20.45,23.95 20.12,24.27 R4.2 R3.1
N$3
  Top 0.152: 9.3,28.7 9.22,28.62
  Top 0.3: R1.1 R2.2 9.22,28.62 | N1.4 9.55,28.95 9.3,28.7
N$5
  Top 0.3: N1.6 12.8,29.75 C1.2
N$7
  Top 0.3: N2.6 21.25,20.7 C4.2
N$21
  Top 0.3: D3.11 19.9,36.31 19,37.21 R19.1
N$22
  Top 0.3: R12.2 H1.C
N$23
  Top 0.3: R13.2 H3.C
N$24
  Top 0.3: R14.2 H2.C
N$25
  Top 0.3: R18.1 23,40.5 23.38,40.12 D3.8
N$26
  Top 0.3: D3.6 33.15,38.85 34,39.7 R17.1
N$27
  Top 0.3: D3.3 37.24,35.04 38,35.8 R16.1
OE_N
  Top 0.15: D3.13 23.73,33.77 23.4,34.1 23.4,35.4 23.7,35.7 26.5,35.7 26.9,36.1 26.9,37.3 26.62,37.58 D3.10 23.82,37.58 23.5,37.9 23.5,39.2 23.8,39.5 27,39.5 28.3,38.2 32.5,38.2 32.8,37.9 32.8,36.6 32.51,36.31 D3.4 30.11,36.31 29.7,35.9 29.7,34.8 30.1,34.4 32.8,34.4 33.2,34 33.2,32.59 33.1,32.49 | D3.1 31.28,31.27 31.9,30.65 31.9,28.5 arc45 31.91,28.48 33.5,26.89 arc-45 34.71,23.96 34.71,8.54 arc45 35.46,6.74 36.46,5.74 arc45 38.25,5 61,5 62.4,6.4 62.4,10.5 61.6,11.3 61.6,12.1 61.75,12.25 D2.15
  Top 0.3: R15.1 33.1,32.49 31.29,32.49 D3.1
OSCIN
  Top 0.15: D2.5 60.85,17.25 60.7,17.1 55.4,17.1 55.35,17.15 G1.3 55.35,19.25 55.75,19.65 C11.1
OSCOUT
  Top 0.15: D2.6 57.75,16.75 57.65,16.65 G1.1 57.65,14.55 57.25,14.15 C10.1
PULSE1
  Top 0.3: R16.2 X4.1
PULSE2
  Top 0.3: R18.2 X5.1
PULSE_1
  Top 0.15: D3.2 29.67,33.77 29.5,33.6 29.5,32.43 31.5,30.43 31.5,28.5 arc45 31.63,28.19 33.21,26.61 arc-45 34.31,23.96 34.31,8.54 arc45 35.17,6.46 36.17,5.46 arc45 38.25,4.6 61.1,4.6 62.7,6.2 62.7,11.72 D2.16
PULSE_2
  Top 0.15: D3.9 26.75,38.85 28.7,36.9 28.7,32.24 30.7,30.24 30.7,28.5 arc45 31.07,27.61 32.64,26.04 arc-45 33.5,23.96 33.5,8.54 arc45 34.6,5.89 35.6,4.89 arc45 38.25,3.79 61.15,3.79 63.31,5.95 63.31,9.3 63.68,9.68 D2.17
RESET_N
  Top 0.15: R5.1 54.02,9.22 55.4,10.6 58.4,10.6 58.9,11.1 58.9,13.4 60.4,14.9 | 61.75,16.25 D2.7 67.65,16.25 73.3,10.6 83.6,10.6 86.5,13.5 94.7,13.5 95.1,13.9 95.1,19.6 94.1,20.6 89.8,20.6 89.2,21.2 89.2,24.7 89.96,25.46 X2.A1
  Top 0.152: 61.75,16.25 61.2,16.25 60.8,15.85 60.8,15.3 60.4,14.9
  Top 0.3: D1.1 52.73,9.3 R5.1
SCL
  Top 0.3: R9.1 49.9,41.17 D4.7 47.7,41.13 47,41.84 X3.4
SDA
  Top 0.3: D4.6 51.86,39.87 R8.1 53.6,39.62 54.1,40.12 54.1,43.7 53.7,44.1 51.5,44.1 51,44.6 X3.2
SW3V3
  Top 0.3: L2.2 25.6,19.5 25.25,19.15 C4.1
  pour Top (no thermals): 23.2,23.3 24.6,23.3 24.9,23.6 25.2,23.6 25.2,22.4 24.9,22.4 24.6,22.7 23.2,22.7
SW5V
  Top 0.3: L1.2 13.8,34.1 14.35,33.55 C1.1
  pour Top (no thermals): 10.2,31.6 10.2,33 9.8,33.4 9.8,33.6 11.2,33.6 11.2,33.4 10.8,33 10.8,31.6
SWCLK
  Top 0.15: R7.1 80.1,21.4 86.7,28 X2.A3
SWCLK-CPU
  Top 0.15: D2.49 72.33,21.4 R7.2
SWDIO
  Top 0.15: X2.A2 88.93,26.73 79.7,17.5 R6.1
SWDIO-CPU
  Top 0.15: R6.2 76.2,17.5 75.45,18.25 D2.46
USART6RX
  Top 0.15: D2.45 73.36,17.75 73.12,17.99 73.12,19.81 73.51,20.2 81,20.2 88.16,27.36 93.2,27.36 93.5,27.66 93.5,29 93.23,29.27 X2.A4
USART6TX
  Top 0.15: D2.44 75.35,17.25 76.1,16.5 80.5,16.5 90.1,26.1 93.6,26.1 94.1,26.6 94.1,30 93.56,30.54 X2.A5
VCAP
  Top 0.3: D2.30 C12.1
VDDA
  Top 0.3: L3.2 57.98,9.22 C13.1 59.1,9.25 59.8,9.95 59.8,12.8 60.25,13.25 D2.13
VIN
  pour Top (no thermals): 8,2.5 8,11.5 12,11.5 12,2.5
VINL
  pour Top (no thermals): 16,18.2 6,18.2 6,20.8 16,20.8
VINR
  pour Top (no thermals): 6,17.8 16,17.8 16,12.5 12.1,12.5 12.1,14.2 6,14.2

### Text on the board
Top: 1
Bottom: 2
tPlace: ERR | RUN | KIMMOLI 2019 | PWR | SAHA CPU | V1.0 | + | -
bPlace: PULSE2 / GND / DIR2 / GND | PULSE1 / GND / DIR1 / GND | +5V / SDA / GND / SCL | IN1 / GND / IN2 / GND / IN3 / GND / IN4 / GND | + | -